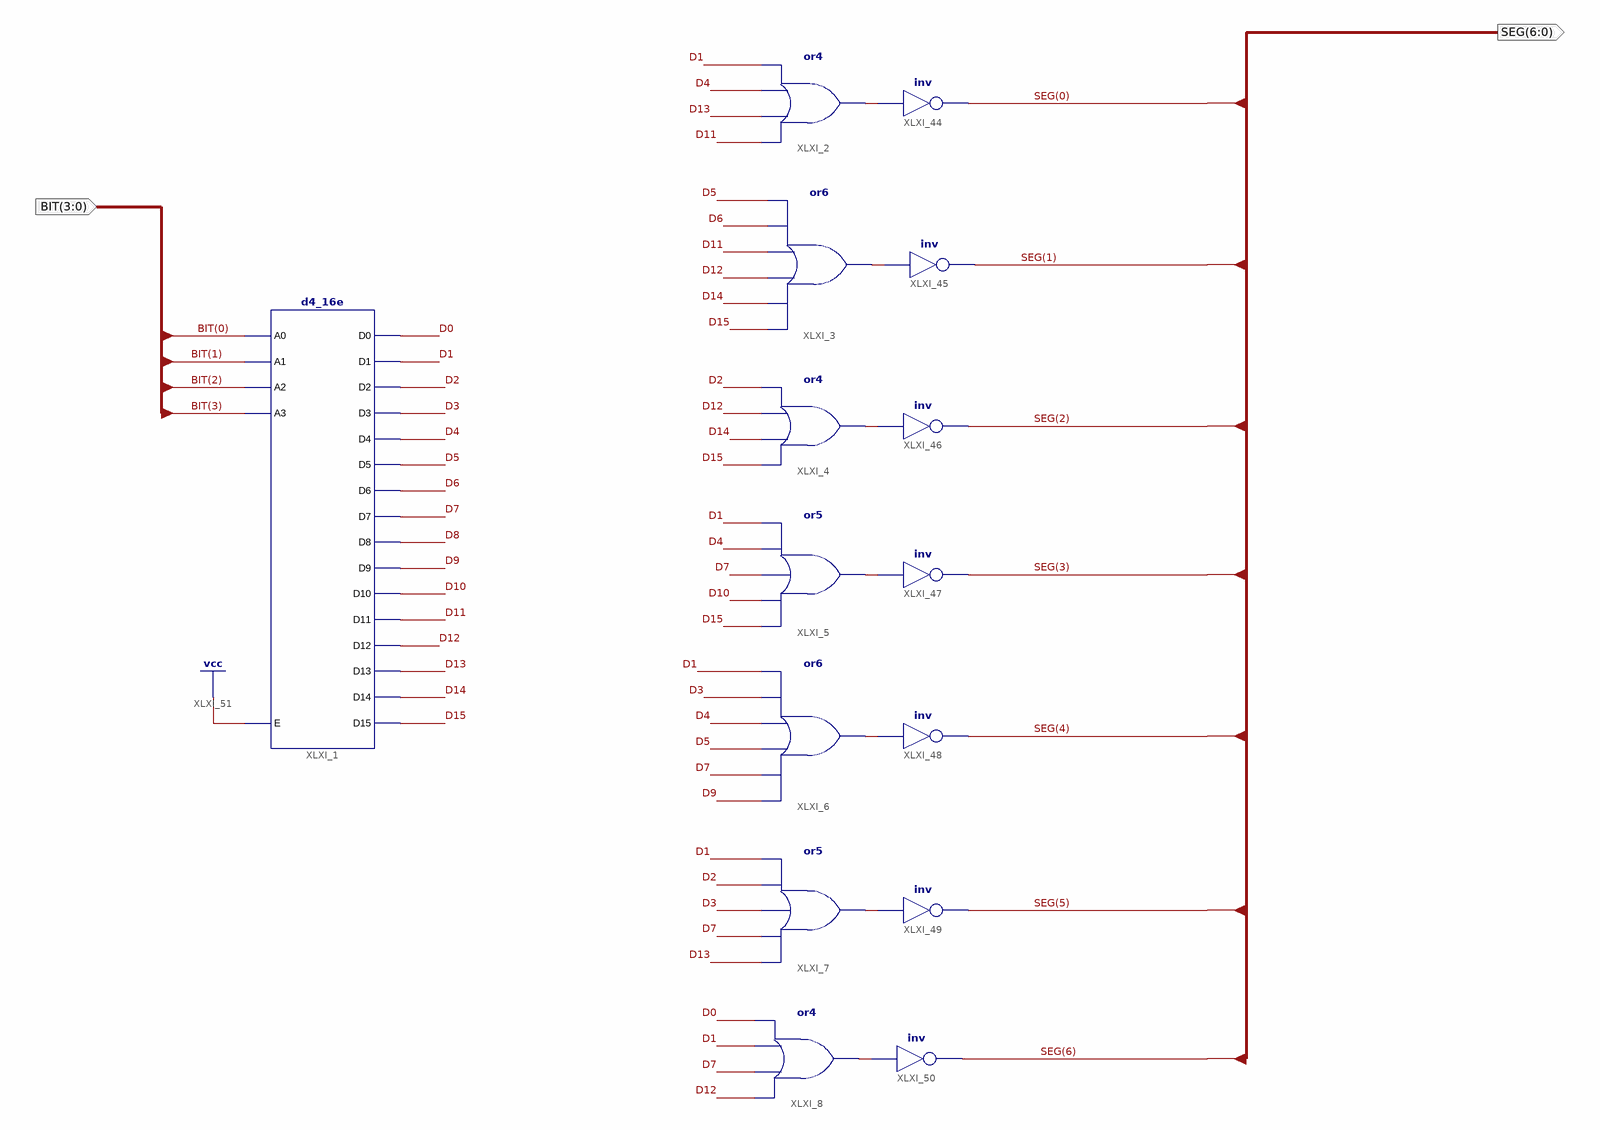
[diagram p0: schematic sheet 1]
// Xilinx ISE schematic BCD_TO_7SEG.sch (spartan6) as structural Verilog: 15 symbols, 2 ports
module BCD_TO_7SEG (
  input  [3:0] BIT,
  output [6:0] SEG
);

  wire D0, D1, D2, D3, D4, D5, D6, D7, D8, D9, D10, D11, D12, D13, D14, D15, XLXN_1, XLXN_2, XLXN_3, XLXN_4,
       XLXN_5, XLXN_6, XLXN_7;

  d4_16e XLXI_1 (
    .A0(BIT[0]), .A1(BIT[1]), .A2(BIT[2]), .A3(BIT[3]), .E(1'b1), .D0(D0), .D1(D1), .D10(D10), .D11(D11),
    .D12(D12), .D13(D13), .D14(D14), .D15(D15), .D2(D2), .D3(D3), .D4(D4), .D5(D5), .D6(D6), .D7(D7),
    .D8(D8), .D9(D9));
  or XLXI_2 (XLXN_1, D11, D13, D4, D1);
  or XLXI_3 (XLXN_2, D15, D14, D12, D11, D6, D5);
  or XLXI_4 (XLXN_3, D15, D14, D12, D2);
  or XLXI_5 (XLXN_4, D15, D10, D7, D4, D1);
  or XLXI_6 (XLXN_5, D9, D7, D5, D4, D3, D1);
  or XLXI_7 (XLXN_6, D13, D7, D3, D2, D1);
  or XLXI_8 (XLXN_7, D12, D7, D1, D0);
  not XLXI_44 (SEG[0], XLXN_1);
  not XLXI_45 (SEG[1], XLXN_2);
  not XLXI_46 (SEG[2], XLXN_3);
  not XLXI_47 (SEG[3], XLXN_4);
  not XLXI_48 (SEG[4], XLXN_5);
  not XLXI_49 (SEG[5], XLXN_6);
  not XLXI_50 (SEG[6], XLXN_7);
endmodule
